# EAGLE design AC_board (EAGLE 9.6.2)
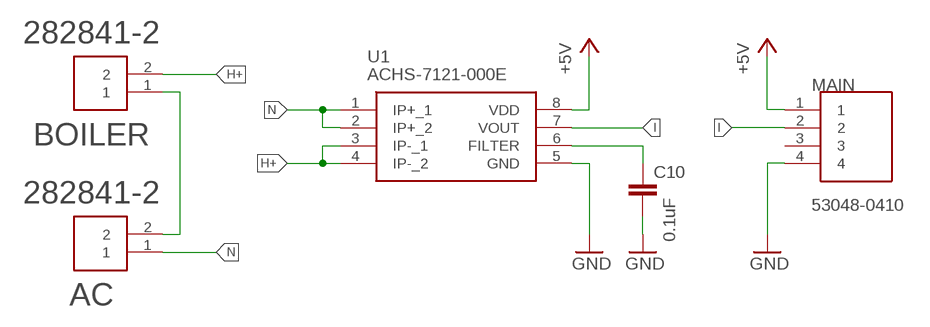
[diagram p0: schematic, sheet 1]

## Parts
AC  282841-2  [TE_282841-2]
BOILER  282841-2  [TE_282841-2]
C10  0.1uF  C-EUC0603K  [C0603K]
MAIN  53048-0410  [530480410]
U1  ACHS-7121-000E  [SOIC127P606X204-8N]

## Nets
+5V: MAIN.1 U1.8(VDD)
GND: C10.2 MAIN.4 U1.5(GND)
H+: BOILER.2 U1.3(IP-_1) U1.4(IP-_2)
I: MAIN.2 U1.7(VOUT)
N: AC.1 U1.1(IP+_1) U1.2(IP+_2)
N$10: C10.1 U1.6(FILTER)
N$11: AC.2 BOILER.1
Unconnected: MAIN.3

## Library data of the parts
AC BOILER = 282841-2:282841-2: TERM BLOCK 2POS SIDE ENT 5.08MM; COMMENT: 282841-2; DESCRIPTION: Conn Terminal Block 2 POS 5.08mm Solder ST Thru-Hole 17.5A/Contact; DIGI-KEY_PART_NUMBER: A98342-ND; DIGI-KEY_PURCHASE_URL: https://www.digikey.com/product-detail/en/te-connectivity-amp-connectors/282841-2/A98342-ND/1136740?utm_source=snapeda&utm_medium=aggregator&utm_campaign=symbol; EU_ROHS_COMPLIANCE: Compliant with Exemptions; MF: TE Connectivity; MP: 282841-2; PACKAGE: None; TE_PURCHASE_URL: https://www.te.com/usa-en/product-282841-2.html?te_bu=Cor&te_type=disp&te_campaign=seda_glo_cor-seda-global-disp-prtnr-fy19-seda-model-bom-cta_sma-317_1&elqCampaignId=32493
C10 = rcl:C-EU: CAPACITOR, European symbol; SPICEPREFIX: C
MAIN = 53048-0410:53048-0410: Headers & Wire Housings RIGHT ANGLE HDR 4P Source: Datasheet <https://www.molex.com/pdm_docs/sd/530480410_sd.pdf>; DESCRIPTION: Headers & Wire Housings RIGHT ANGLE HDR 4P; HEIGHT: 3.7mm; MANUFACTURER_NAME: Molex; MANUFACTURER_PART_NUMBER: 53048-0410; MOUSER_PART_NUMBER: 538-53048-0410; MOUSER_PRICE-STOCK: https://www.mouser.co.uk/ProductDetail/Molex/53048-0410?qs=359VwiUTsp2msj5Tobchuw%3D%3D
U1 = ACHS-7121-000E:ACHS-7121-000E: Board Mount Current Sensors Hall Effect IC LF 10A 185mV/A Source: Datasheet <https://docs.broadcom.com/docs/ACHS-712x-DS101>; DESCRIPTION: Board Mount Current Sensors Hall Effect IC LF 10A 185mV/A; HEIGHT: 2.035mm; MANUFACTURER_NAME: Avago Technologies; MANUFACTURER_PART_NUMBER: ACHS-7121-000E; MOUSER_PART_NUMBER: 630-ACHS-7121-000E; MOUSER_PRICE-STOCK: https://www.mouser.co.uk/ProductDetail/Broadcom-Avago/ACHS-7121-000E?qs=w%2Fv1CP2dgqo3exDSmSklAg%3D%3D

## Board
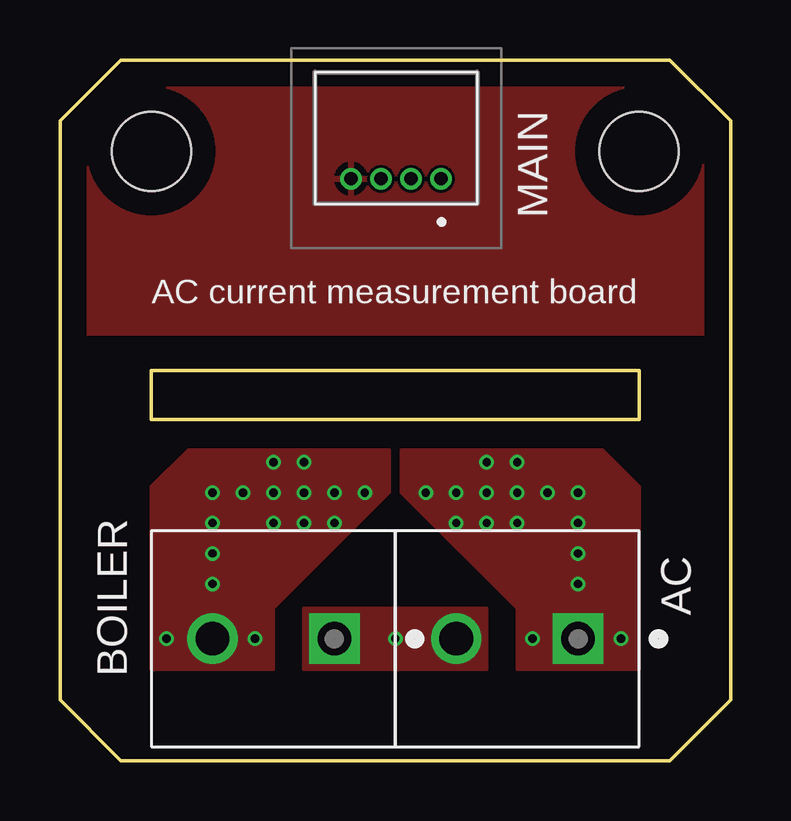
[diagram p1: board, top side]
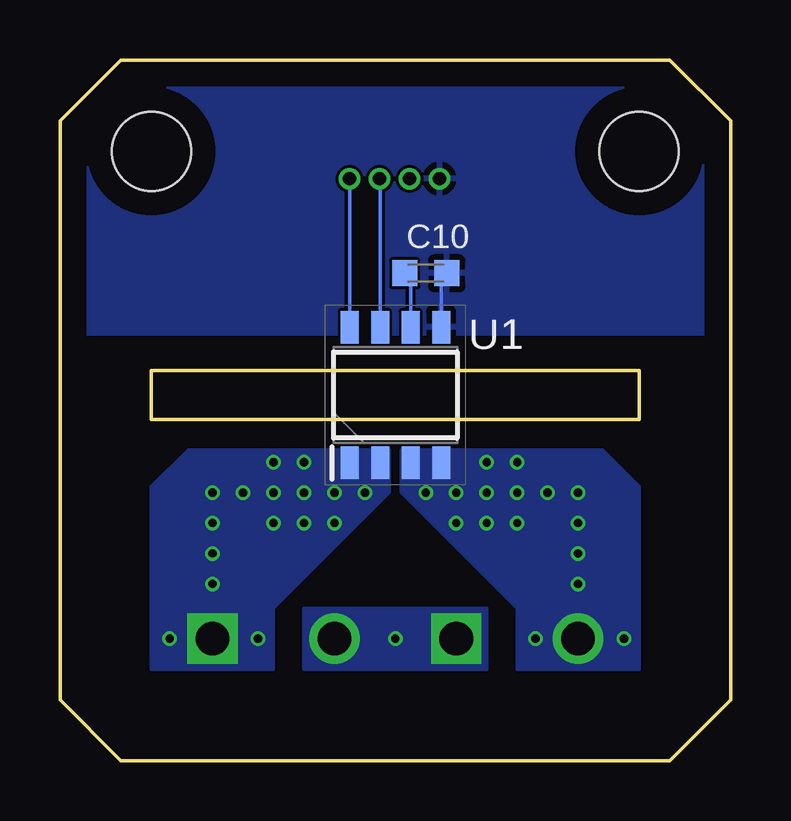
[diagram p2: board, bottom side, seen from below]

Size 27.94 x 29.21 mm. Coordinates in mm from the lower left corner, seen from the top.
Outline: 27.94,2.54 25.4,0 2.54,0 0,2.54 0,26.67 2.54,29.21 25.4,29.21 27.94,26.67 27.94,2.54
Outline: 3.81,16.26 3.81,14.22 24.13,14.22 24.13,16.26 3.81,16.26
Copper layers (1*16): Top 0.035mm / dielectric 1.5mm / Bottom 0.035mm
Design rules "default *": minimum track width 6mil, minimum drill 0.2mm, track to track 5mil, track to pad 5mil, pad to pad 5mil, via to via 5mil, smd to smd 5mil, copper to edge 40mil, drill to drill 6mil, minimum pad ring 5mil, minimum via ring 5mil, stop-mask expansion 4mil, vias tented up to drill 0mil, thermal gap 10mil
Holes 3.3 mm at 24.13,25.4 3.81,25.4

### Footprints (pad centres in the part's own frame; a part is rotated, then mirrored left to right if it is on the bottom)
TE_282841-2 = drill 1.4 square: 1 -2.54,0 | drill 1.4: 2 2.54,0
C0603K = smd 1.05 x 1.08: 1 -0.875,0; 2 0.875,0
530480410 = drill 0.55 pad 0.9: 1 0,0; 2 -1.25,0; 3 -2.5,0; 4 -3.75,0
SOIC127P606X204-8N = smd 1.35 x 0.75: 1 -2.825,1.905; 2 -2.825,0.635; 3 -2.825,-0.635; 4 -2.825,-1.905; 5 2.825,-1.905; 6 2.825,-0.635; 7 2.825,0.635; 8 2.825,1.905

### Placement (x,y rotation side)
AC  19.05,5.08 180 top
BOILER  8.89,5.08 180 top
C10  12.7,20.32 0 bottom
MAIN  15.88,24.26 0 top
U1  13.97,15.24 90 bottom

### Tracks (layer width: path | path; a pad name or v marks a point on that pad's centre or on a via)
+5V
  Bottom 0.152: U1.8 MAIN.1
GND
  Bottom 0.152: U1.5 12.06,20.08 C10.2
  pour Top: -1.27,17.78 29.21,17.78 29.21,30.48 -1.27,30.48
  pour Bottom: -1.27,17.78 -1.27,30.48 29.21,30.48 29.21,17.78
H+  (via drill 0.35)
  other vias: 10.16,12.45 10.16,11.18 11.43,11.18 12.7,11.18 11.43,9.91 10.16,9.91 8.89,9.91 8.89,11.18 8.89,12.45 8.13,5.08 4.45,5.08 7.62,11.18 6.35,11.18 6.35,9.91 6.35,8.64 6.35,7.37
  pour Bottom (no thermals): 8.89,3.81 8.89,6.35 13.72,11.18 13.72,12.95 5.33,12.95 3.81,11.43 3.81,3.81
  pour Top (no thermals): 8.89,3.81 8.89,6.35 13.72,11.18 13.72,12.95 5.33,12.95 3.81,11.43 3.81,3.81
I
  Bottom 0.152: U1.7 14.61,24.24 MAIN.2
N  (via drill 0.35)
  other vias: 17.78,12.45 17.78,11.18 16.51,11.18 15.24,11.18 16.51,9.91 17.78,9.91 19.05,9.91 19.05,11.18 19.05,12.45 19.68,5.08 23.37,5.08 20.32,11.18 21.59,11.18 21.59,9.91 21.59,8.64 21.59,7.37
  pour Bottom (no thermals): 24.13,3.81 19.05,3.81 19.05,6.35 14.22,11.18 14.22,12.95 22.61,12.95 24.13,11.43
  pour Top (no thermals): 19.05,3.81 19.05,6.35 14.22,11.18 14.22,12.95 22.61,12.95 24.13,11.43 24.13,3.81
N$10
  Bottom 0.152: U1.6 13.34,20.08 C10.1
N$11  (via drill 0.35)
  other vias: 13.97,5.08
  pour Top (no thermals): 10.16,3.81 10.16,6.35 17.78,6.35 17.78,3.81
  pour Bottom (no thermals): 10.16,3.81 10.16,6.35 17.78,6.35 17.78,3.81

### Text on the board
tNames: AC current measurement board